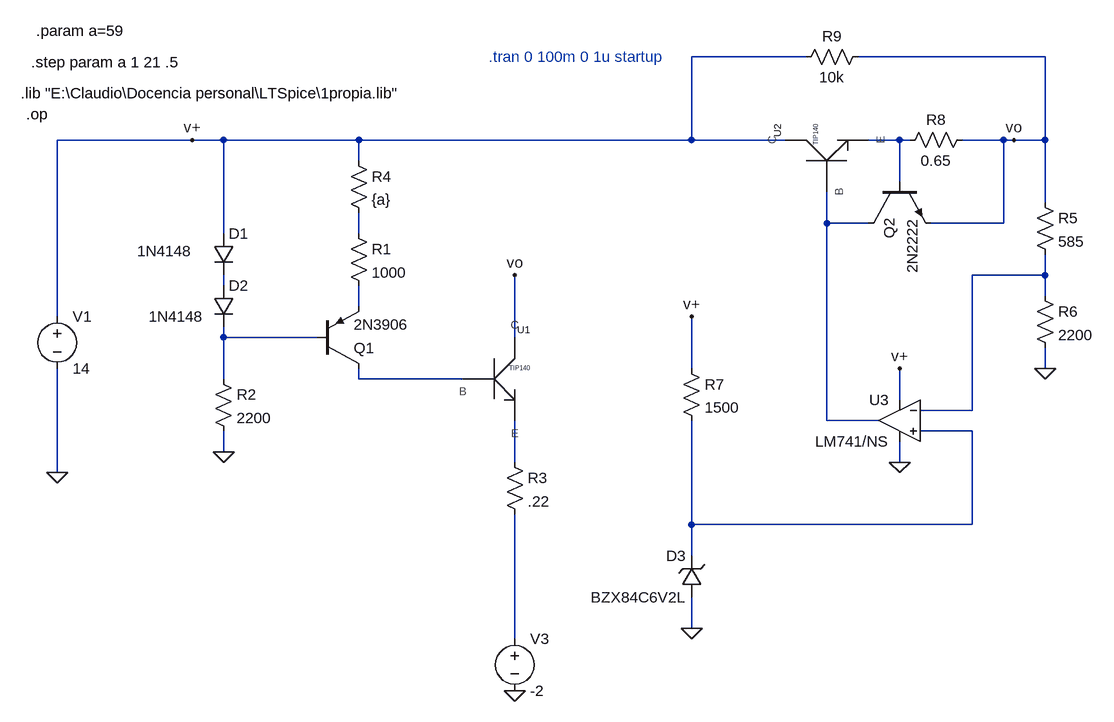
[diagram p0: schematic cargavariable2.asc]
cargavariable2.asc, the LTspice schematic file:
Version 4
SHEET 1 1596 680
WIRE 1088 -352 912 -352
WIRE 1456 -352 1168 -352
WIRE 144 -224 -64 -224
WIRE 192 -224 144 -224
WIRE 400 -224 192 -224
WIRE 912 -224 912 -352
WIRE 912 -224 400 -224
WIRE 1056 -224 912 -224
WIRE 1232 -224 1184 -224
WIRE 1248 -224 1232 -224
WIRE 1392 -224 1328 -224
WIRE 1408 -224 1392 -224
WIRE 1456 -224 1456 -352
WIRE 1456 -224 1408 -224
WIRE 400 -192 400 -224
WIRE 1232 -160 1232 -224
WIRE 1456 -128 1456 -224
WIRE 1120 -96 1120 -144
WIRE 1184 -96 1120 -96
WIRE 1392 -96 1392 -224
WIRE 1392 -96 1280 -96
WIRE 192 -80 192 -224
WIRE 400 -80 400 -112
WIRE 1456 -16 1456 -48
WIRE 1456 -16 1344 -16
WIRE 192 0 192 -16
WIRE 1456 16 1456 -16
WIRE 400 32 400 0
WIRE -64 48 -64 -224
WIRE 192 80 192 64
WIRE 336 80 192 80
WIRE 640 80 640 -16
WIRE 912 128 912 48
WIRE 1456 128 1456 96
WIRE 192 144 192 80
WIRE 400 144 400 128
WIRE 560 144 400 144
WIRE 1232 176 1232 128
WIRE 1344 192 1344 -16
WIRE 1344 192 1264 192
WIRE 1120 208 1120 -96
WIRE 1200 208 1120 208
WIRE 1344 224 1264 224
WIRE 192 256 192 224
WIRE 640 272 640 208
WIRE 1232 272 1232 240
WIRE -64 288 -64 128
WIRE 912 368 912 208
WIRE 1344 368 1344 224
WIRE 1344 368 912 368
WIRE 912 416 912 368
WIRE 912 528 912 480
WIRE 640 544 640 352
FLAG -64 288 0
FLAG 640 624 0
FLAG 192 256 0
FLAG 640 -16 vo
FLAG 1232 128 v+
FLAG 144 -224 v+
FLAG 1232 272 0
FLAG 1456 128 0
FLAG 912 48 v+
FLAG 912 528 0
FLAG 1408 -224 vo
DATAFLAG 400 16 ""
DATAFLAG 640 224 ""
DATAFLAG 1440 -224 ""
SYMBOL voltage -64 32 R0
WINDOW 123 0 0 Left 0
WINDOW 39 0 0 Left 0
SYMATTR InstName V1
SYMATTR Value 14
SYMBOL res 624 256 R0
SYMATTR InstName R3
SYMATTR Value .22
SYMBOL voltage 640 528 R0
WINDOW 123 0 0 Left 0
WINDOW 39 0 0 Left 0
SYMATTR InstName V3
SYMATTR Value -2
SYMBOL Propia\\Darlington\ npn 608 144 R0
SYMATTR Value TIP140
SYMATTR InstName U1
SYMBOL pnp 336 128 M180
SYMATTR InstName Q1
SYMATTR Value 2N3906
SYMBOL res 384 -96 R0
SYMATTR InstName R1
SYMATTR Value 1000
SYMBOL diode 176 -80 R0
WINDOW 3 -117 27 Left 2
SYMATTR Value 1N4148
SYMATTR InstName D1
SYMBOL diode 176 0 R0
WINDOW 3 -99 48 Left 2
SYMATTR Value 1N4148
SYMATTR InstName D2
SYMBOL res 176 128 R0
SYMATTR InstName R2
SYMATTR Value 2200
SYMBOL res 384 -208 R0
SYMATTR InstName R4
SYMATTR Value {a}
SYMBOL Propia\\Darlington\ npn 1120 -192 R270
SYMATTR Value TIP140
SYMATTR InstName U2
SYMBOL OpAmps\\opamp2 1232 144 M0
SYMATTR InstName U3
SYMATTR Value LM741/NS
SYMBOL res 1440 -144 R0
SYMATTR InstName R5
SYMATTR Value 585
SYMBOL res 1440 0 R0
SYMATTR InstName R6
SYMATTR Value 2200
SYMBOL res 896 112 R0
SYMATTR InstName R7
SYMATTR Value 1500
SYMBOL zener 928 480 R180
WINDOW 0 24 64 Left 2
WINDOW 3 24 0 Left 2
SYMATTR InstName D3
SYMATTR Value BZX84C6V2L
SYMBOL res 1344 -240 R90
WINDOW 0 0 56 VBottom 2
WINDOW 3 32 56 VTop 2
SYMATTR InstName R8
SYMATTR Value 0.65
SYMBOL npn 1184 -160 M90
SYMATTR InstName Q2
SYMATTR Value 2N2222
SYMBOL res 1184 -368 R90
WINDOW 0 0 56 VBottom 2
WINDOW 3 32 56 VTop 2
SYMATTR InstName R9
SYMATTR Value 10k
TEXT -120 -296 Left 2 !.lib "E:\\Claudio\\Docencia personal\\LTSpice\\1propia.lib"
TEXT -112 -264 Left 2 !.op
TEXT -104 -344 Left 2 !.step param a 1 21 .5
TEXT -96 -392 Left 2 !.param a=59
TEXT 600 -352 Left 2 ;.tran 0 100m 0 1u startup

The netlist it stands for:
* cargavariable2.asc
V1 v+ 0 14
R3 N010 N011 .22
V3 N011 0 -2
XU1 vo N008 N010 TIP140  ; pins C B E
Q1 N008 N007 N006 0 2N3906
R1 N003 N006 1000
D1 v+ N005 1N4148
D2 N005 N007 1N4148
R2 N007 0 2200
R4 v+ N003 {a}
XU2 v+ N002 N001 TIP140  ; pins C B E
XU3 N009 N004 v+ 0 N002 LM741/NS  ; pins In+ In- V+ V- OUT
R5 vo N004 585
R6 N004 0 2200
R7 v+ N009 1500
D3 0 N009 BZX84C6V2L
R8 vo N001 0.65
Q2 N002 N001 vo 0 2N2222
R9 vo v+ 10k
.model D D
.lib standard.dio
.model NPN NPN
.model PNP PNP
.lib standard.bjt
.lib "E:\Claudio\Docencia personal\LTSpice\1propia.lib"
.op
.step param a 1 21 .5
.param a=59
* .tran 0 100m 0 1u startup
.backanno
.end